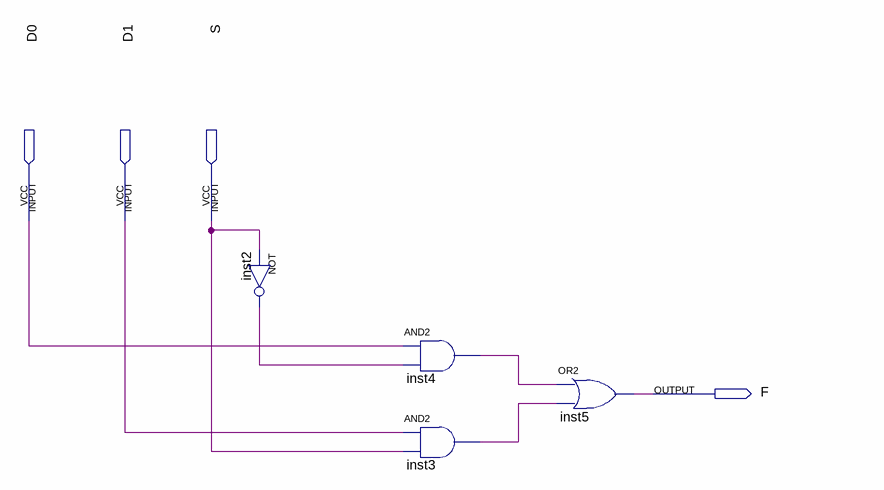
[diagram p0: schematic sheet]
// Quartus schematic marutipre_1.bdf as structural Verilog: 4 symbols, 4 pins
module marutipre_1 (
  input  D0,
  input  D1,
  input  S,
  output F
);

  wire inst2_out, inst3_out, inst4_out;

  not inst2 (inst2_out, S);
  and inst4 (inst4_out, D0, inst2_out);
  and inst3 (inst3_out, D1, S);
  or inst5 (F, inst4_out, inst3_out);
endmodule
